# EAGLE schematic mini-JLT (EAGLE 9.6.2)
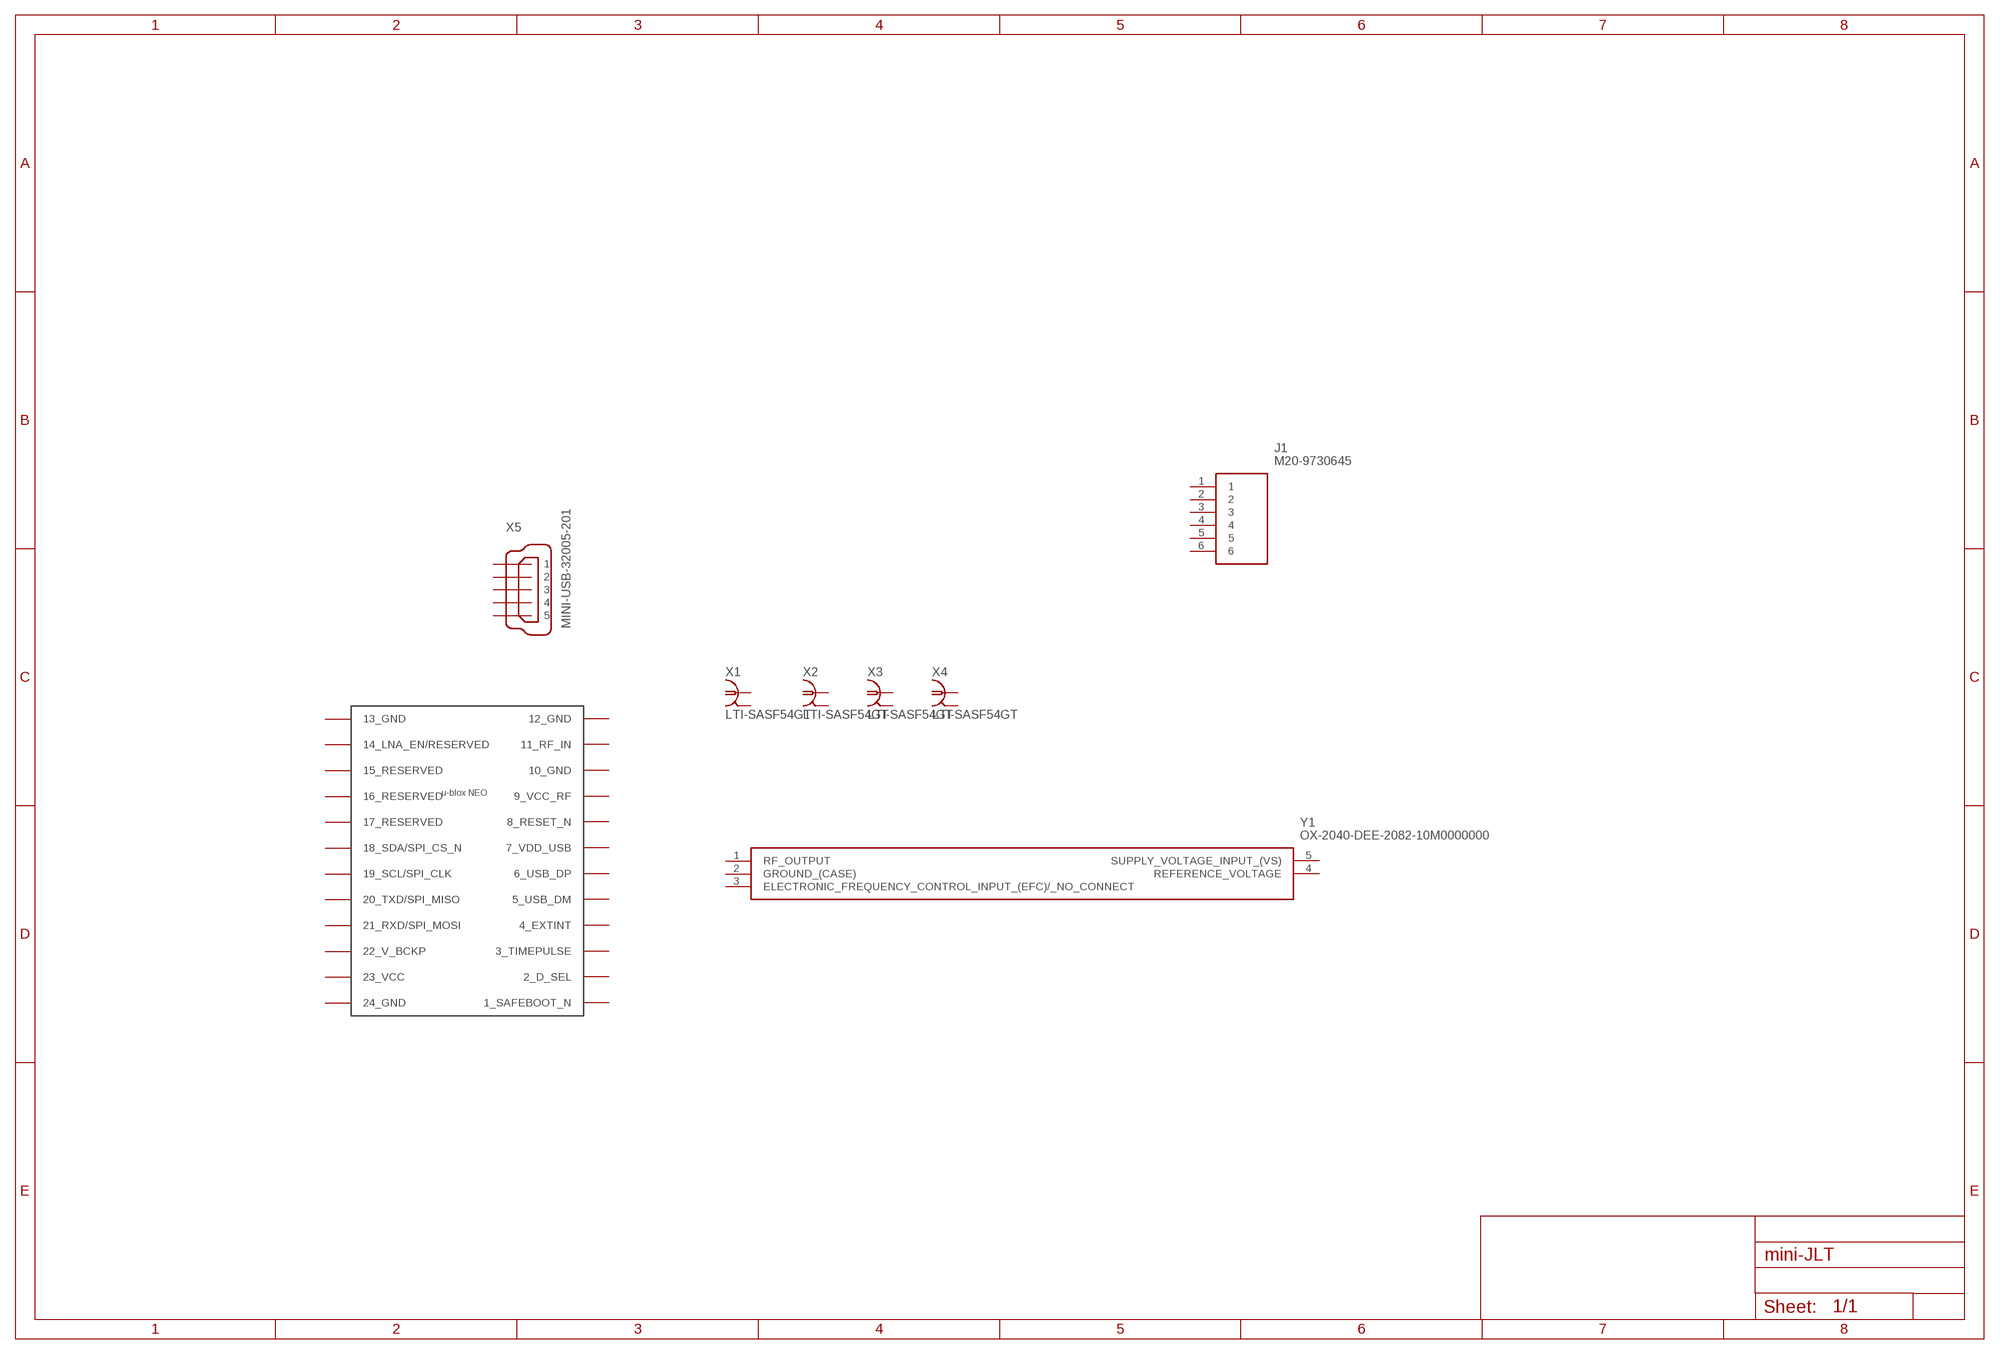
[diagram p0: schematic, sheet 1]

## Parts
J1  M20-9730645  [HDRV6W66P0X254_1X6_1524X254X96]
U$1  NEO-M8  [NEO-M8]
X1  LTI-SASF54GT  [LTI-SASF54GT]
X2  LTI-SASF54GT  [LTI-SASF54GT]
X3  LTI-SASF54GT  [LTI-SASF54GT]
X4  LTI-SASF54GT  [LTI-SASF54GT]
X5  MINI-USB-32005-201  [32005-201]
Y1  OX-2040-DEE-2082-10M0000000  [OX2040DEE208210M0000000]
Unconnected: J1.1 J1.2 J1.3 J1.4 J1.5 J1.6 U$1.1(1_SAFEBOOT_N) U$1.2(2_D_SEL) U$1.3(3_TIMEPULSE) U$1.4(4_EXTINT) U$1.5(5_USB_DM) U$1.6(6_USB_DP) U$1.7(7_VDD_USB) U$1.8(8_RESET_N) U$1.9(9_VCC_RF) U$1.10(10_GND) U$1.11(11_RF_IN) U$1.12(12_GND) U$1.13(13_GND) U$1.14(14_LNA_EN/RESERVED) U$1.15(15_RESERVED) U$1.16(16_RESERVED) U$1.17(17_RESERVED) U$1.18(18_SDA/SPI_CS_N) U$1.19(19_SCL/SPI_CLK) U$1.20(20_TXD/SPI_MISO) U$1.21(21_RXD/SPI_MOSI) U$1.22(22_V_BCKP) U$1.23(23_VCC) U$1.24(24_GND) X1.1 X1.2 X1.3 X1.4 X1.5 X2.1 X2.2 X2.3 X2.4 X2.5 X3.1 X3.2 X3.3 X3.4 X3.5 X4.1 X4.2 X4.3 X4.4 X4.5 X5.1 X5.2 X5.3 X5.4 X5.5 Y1.1(RF_OUTPUT) Y1.2(GROUND_(CASE)) Y1.3(ELECTRONIC_FREQUENCY_CONTROL_INPUT_(EFC)/_NO_CONNECT) Y1.4(REFERENCE_VOLTAGE) Y1.5(SUPPLY_VOLTAGE_INPUT_(VS))

## Library data of the parts
J1 = M20-9730645:M20-9730645: Headers & Wire Housings 06 SIL VERTICAL PIN HEADER GOLD HT Source: Datasheet <https://cdn.harwin.com/pdfs/C001XX_M20_Series_Connectors.pdf>; DESCRIPTION: Headers & Wire Housings 06 SIL VERTICAL PIN HEADER GOLD HT; HEIGHT: 9.64mm; MANUFACTURER_NAME: HARWIN; MANUFACTURER_PART_NUMBER: M20-9730645; MOUSER_PART_NUMBER: 855-M20-9730645; MOUSER_PRICE-STOCK: https://www.mouser.com/Search/Refine.aspx?Keyword=855-M20-9730645
U$1 = ubloxLib:NEO-M8: u-blox NEO GNSS module
X1-X4 = con-coax:LTI-SASF54GT: SMA vertical PCB thrue hole jack Source: Lighthorse Technologies, inc. SASF54GT.pdf; OC_FARNELL: unknown; OC_NEWARK: unknown
X5 = con-cypressindustries:MINI-USB-: MINI USB-B Conector Source: www.cypressindustries.com; OC_FARNELL: unknown; OC_NEWARK: unknown
Y1 = OX-2040-DEE-2082-10M0000000:OX-2040-DEE-2082-10M0000000: Sine Output Oscillator, 10MHz Nom Source: Datasheet <https://www.vectron.com/products/ocxo/ox-204.pdf>; DESCRIPTION: Sine Output Oscillator, 10MHz Nom; HEIGHT: 15mm; MANUFACTURER_NAME: Vectron; MANUFACTURER_PART_NUMBER: OX-2040-DEE-2082-10M0000000